# EAGLE design pcbWithuE (EAGLE 9.1.3)

## Sheet 1 of 2: microcontroller
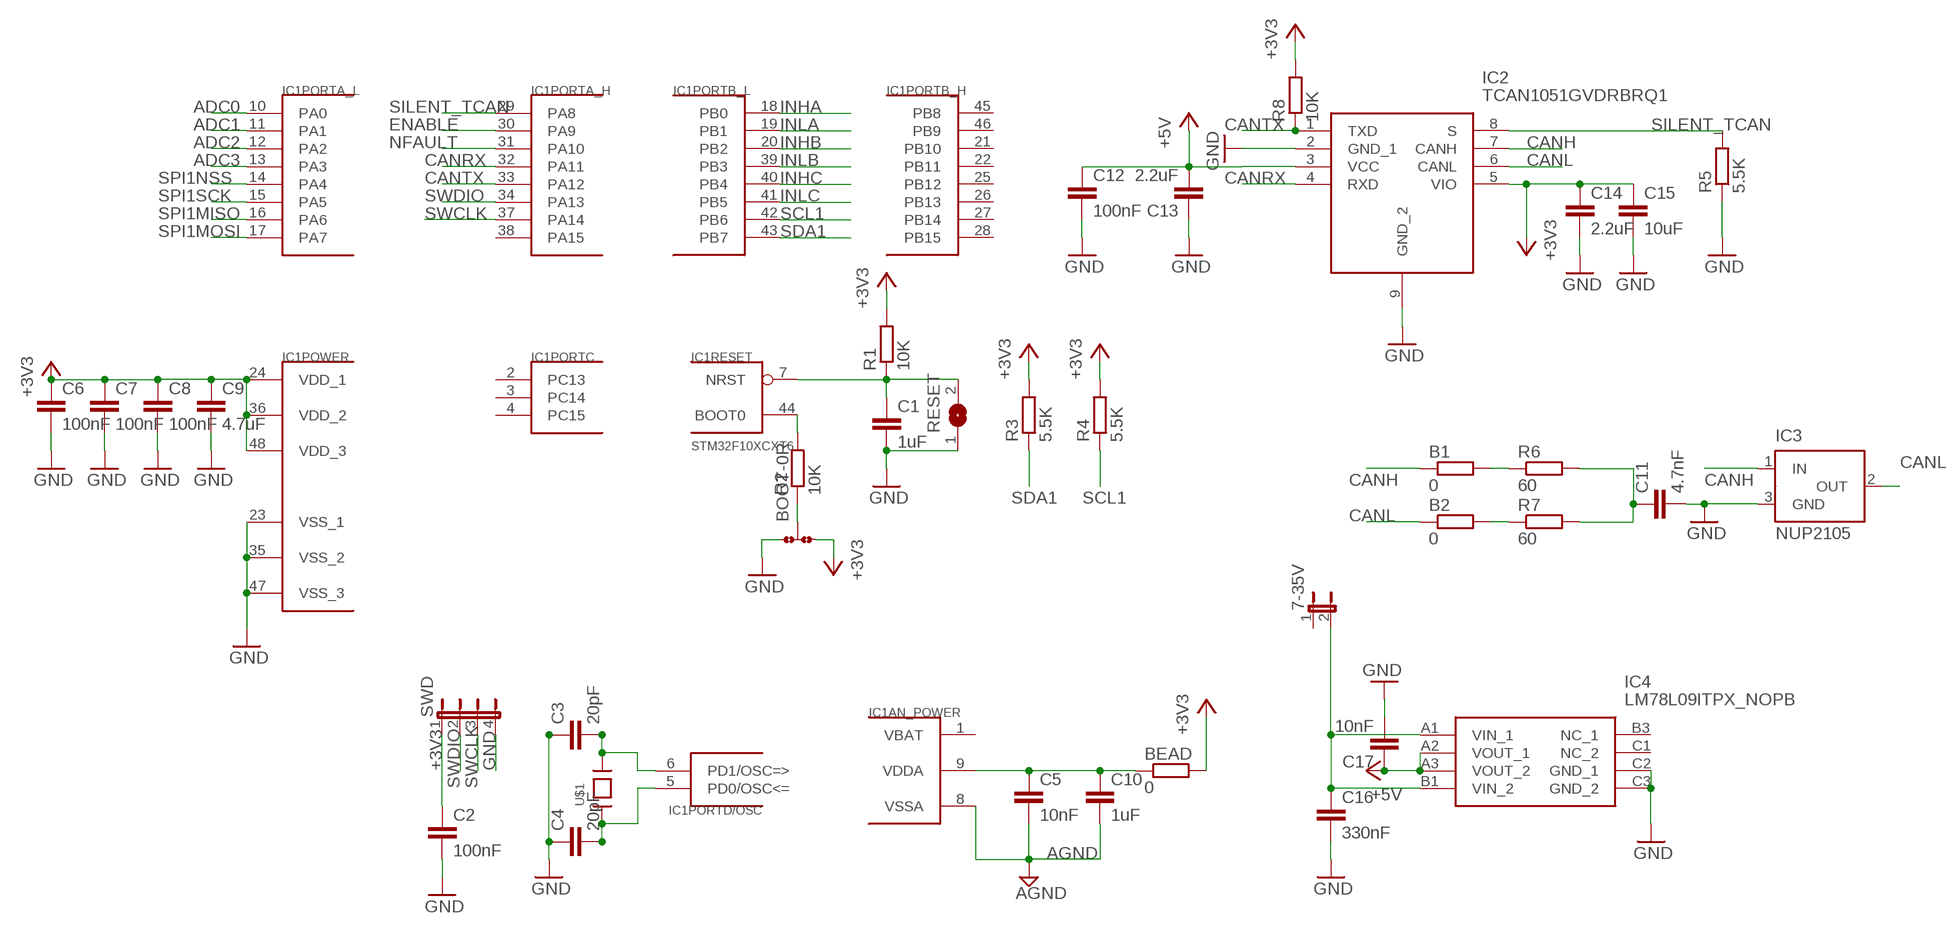
[diagram p0: schematic, sheet 1]

### Parts
7-35V  JP1E  [JP1]
B1  0  R-EU_R0805  [R0805]
B2  0  R-EU_R0805  [R0805]
BEAD  0  R-EU_R0805  [R0805]
BOOT  0R-JUMPB  [B0R-JMP]
C1  1uF  C-EUC0603  [C0603]
C2  100nF  C-EUC0603  [C0603]
C3  20pF  C-EUC0603  [C0603]
C4  20pF  C-EUC0603  [C0603]
C5  10nF  C-EUC0603  [C0603]
C6  100nF  C-EUC0603  [C0603]
C7  100nF  C-EUC0603  [C0603]
C8  100nF  C-EUC0603  [C0603]
C9  4.7uF  C-EUC0805K  [C0805K]
C10  1uF  C-EUC0805K  [C0805K]
C11  4.7nF  C-EUC0402K  [C0402K]
C12  100nF  C-EUC0402K  [C0402K]
C13  2.2uF  C-EUC0402K  [C0402K]
C14  2.2uF  C-EUC0603K  [C0603K]
C15  10uF  C-EUC0603K  [C0603K]
C16  330nF  C-EUC0603  [C0603]
C17  10nF  C-EUC0603  [C0603]
IC1  STM32F10XCXT6  [TQFP48]
IC2  TCAN1051GVDRBRQ1  [DRB-8]
IC3  NUP2105  MAX6520  [SOT23]
IC4  LM78L09ITPX_NOPB  [BGA8C50P3X3_131X131X58]
R1  10K  R-EU_R0603  [R0603]
R2  10K  R-EU_R0603  [R0603]
R3  5.5K  R-EU_R0603  [R0603]
R4  5.5K  R-EU_R0603  [R0603]
R5  5.5K  R-EU_R0402  [R0402]
R6  60  R-EU_R0603  [R0603]
R7  60  R-EU_R0603  [R0603]
R8  10K  R-EU_R0402  [R0402]
RESET  SJ  [SJ]
SWD  JP4E  [JP4]
U$1  QUARZ8MHZ  [SMD5*3.2MM]

### Nets
+3V3: BEAD.2 BOOT.3 C2.1 C6.1 C7.1 C8.1 C9.1 C14.1 C15.1 IC1.24(POWER:VDD_1) IC1.36(POWER:VDD_2) IC1.48(POWER:VDD_3) IC2.5(VIO) R1.2 R3.2 R4.2 R8.2 SWD.1 ; also sheet 2
+5V: C12.1 C13.2 C17.1 IC2.3(VCC) IC4.A2(VOUT_1) IC4.A3(VOUT_2)
ADC0: IC1.10(PORTA_L:PA0)
ADC1: IC1.11(PORTA_L:PA1)
ADC2: IC1.12(PORTA_L:PA2)
ADC3: IC1.13(PORTA_L:PA3)
AGND: C5.2 C10.2 IC1.8(AN_POWER:VSSA) ; also sheet 2
CANH: B1.1 IC2.7(CANH) IC3.1(IN)
CANL: B2.1 IC2.6(CANL) IC3.2(OUT)
CANRX: IC1.32(PORTA_H:PA11) IC2.4(RXD)
CANTX: IC1.33(PORTA_H:PA12) IC2.1(TXD) R8.1
ENABLE: IC1.30(PORTA_H:PA9) ; also sheet 2
GND: BOOT.1 C1.2 C2.2 C3.1 C4.1 C6.2 C7.2 C8.2 C9.2 C11.2 C12.2 C13.1 C14.2 C15.2 C16.2 C17.2 IC1.23(POWER:VSS_1) IC1.35(POWER:VSS_2) IC1.47(POWER:VSS_3) IC2.2(GND_1) IC2.9(GND_2) IC3.3(GND) IC4.C2(GND_1) IC4.C3(GND_2) R5.1 RESET.1 SWD.4 ; also sheet 2
INHA: IC1.18(PORTB_L:PB0) ; also sheet 2
INHB: IC1.20(PORTB_L:PB2) ; also sheet 2
INHC: IC1.40(PORTB_L:PB4) ; also sheet 2
INLA: IC1.19(PORTB_L:PB1) ; also sheet 2
INLB: IC1.39(PORTB_L:PB3) ; also sheet 2
INLC: IC1.41(PORTB_L:PB5) ; also sheet 2
N$1: C1.1 IC1.7(RESET:NRST) R1.1 RESET.2
N$2: C3.2 IC1.6(PORTD/OSC:PD1/OSC=>) U$1.P$2
N$3: C4.2 IC1.5(PORTD/OSC:PD0/OSC<=) U$1.P$1
N$4: IC1.44(RESET:BOOT0) R2.2
N$5: BEAD.1 C5.1 C10.1 IC1.9(AN_POWER:VDDA)
N$6: BOOT.2 R2.1
N$7: C11.1 R6.2 R7.2
N$8: B1.2 R6.1
N$9: B2.2 R7.1
N$10: 7-35V.2 C16.1 IC4.A1(VIN_1) IC4.B1(VIN_2)
NFAULT: IC1.31(PORTA_H:PA10) ; also sheet 2
SCL1: IC1.42(PORTB_L:PB6) R4.1
SDA1: IC1.43(PORTB_L:PB7) R3.1
SILENT_TCAN: IC1.29(PORTA_H:PA8) IC2.8(S) R5.2
SPI1MISO: IC1.16(PORTA_L:PA6)
SPI1MOSI: IC1.17(PORTA_L:PA7)
SPI1NSS: IC1.14(PORTA_L:PA4)
SPI1SCK: IC1.15(PORTA_L:PA5)
SWCLK: IC1.37(PORTA_H:PA14) SWD.3
SWDIO: IC1.34(PORTA_H:PA13) SWD.2
Unconnected: 7-35V.1 IC1.2(PORTC:PC13) IC1.3(PORTC:PC14) IC1.4(PORTC:PC15) IC1.21(PORTB_H:PB10) IC1.22(PORTB_H:PB11) IC1.25(PORTB_H:PB12) IC1.26(PORTB_H:PB13) IC1.27(PORTB_H:PB14) IC1.28(PORTB_H:PB15) IC1.38(PORTA_H:PA15) IC1.45(PORTB_H:PB8) IC1.46(PORTB_H:PB9) IC4.B3(NC_1) IC4.C1(NC_2)

## Sheet 2 of 2: motor driver
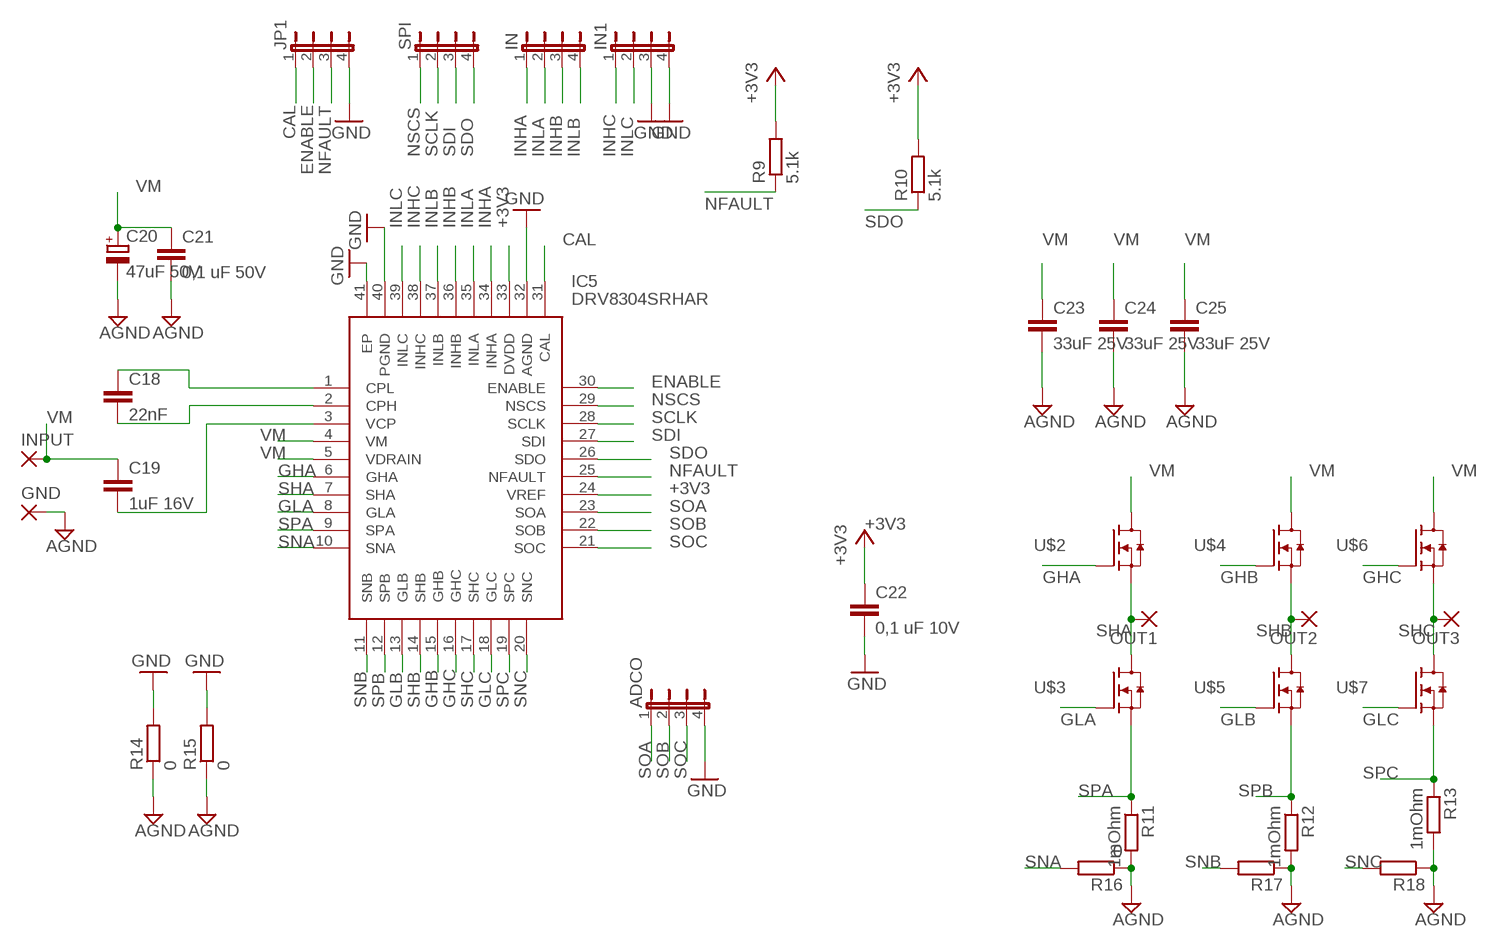
[diagram p1: schematic, sheet 2]

### Parts
ADCO  JP4E  [JP4]
C18  22nF  C-EUC0805K  [C0805K]
C19  1uF 16V  C-EUC0805K  [C0805K]
C20  47uF 50V  CPOL-EUE7.5-16  [E7,5-16]
C21  0,1 uF 50V  C-EUC0805K  [C0805K]
C22  0,1 uF 10V  C-EUC0805K  [C0805K]
C23  33uF 25V  C-EUC1206K  [C1206K]
C24  33uF 25V  C-EUC1206K  [C1206K]
C25  33uF 25V  C-EUC1206K  [C1206K]
GND  3,17/1,3  [3,17/1,3]
IC5  DRV8304SRHAR  [QFN50P600X600X100-41N]
IN  JP4E  [JP4]
IN1  JP4E  [JP4]
INPUT  3,17/1,3  [3,17/1,3]
JP1  JP4E  [JP4]
OUT1  SMD2  [SMD1,27-2,54]
OUT2  SMD2  [SMD1,27-2,54]
OUT3  SMD2  [SMD1,27-2,54]
R9  5.1k  R-EU_R0805  [R0805]
R10  5.1k  R-EU_R0805  [R0805]
R11  1mOhm  R-EU_R1216_SHUNT  [1216]
R12  1mOhm  R-EU_R1216_SHUNT  [1216]
R13  1mOhm  R-EU_R1216_SHUNT  [1216]
R14  0  R-EU_R0805W  [R0805W]
R15  0  R-EU_R0805W  [R0805W]
R16  0  R-EU_R0201  [R0201]
R17  R-EU_R0201  [R0201]
R18  R-EU_R0201  [R0201]
SPI  JP4E  [JP4]
U$2  SIRA80DP-T1-RE3-CLASSIC  [SI7852ADPT1GE3]
U$3  SIRA80DP-T1-RE3-CLASSIC  [SI7852ADPT1GE3]
U$4  SIRA80DP-T1-RE3-CLASSIC  [SI7852ADPT1GE3]
U$5  SIRA80DP-T1-RE3-CLASSIC  [SI7852ADPT1GE3]
U$6  SIRA80DP-T1-RE3-CLASSIC  [SI7852ADPT1GE3]
U$7  SIRA80DP-T1-RE3-CLASSIC  [SI7852ADPT1GE3]

### Nets
+3V3: C22.1 IC5.24(VREF) IC5.33(DVDD) R9.2 R10.2 ; also sheet 1
AGND: C20.- C21.2 C23.2 C24.2 C25.2 GND.1(P) R11.P$2 R11.P$4 R12.P$2 R12.P$4 R13.P$2 R13.P$4 R14.1 R15.1 R16.1 R17.1 R18.1 ; also sheet 1
CAL: IC5.31(CAL) JP1.1
ENABLE: IC5.30(ENABLE) JP1.2 ; also sheet 1
GHA: IC5.6(GHA) U$2.4(G)
GHB: IC5.15(GHB) U$4.4(G)
GHC: IC5.16(GHC) U$6.4(G)
GLA: IC5.8(GLA) U$3.4(G)
GLB: IC5.13(GLB) U$5.4(G)
GLC: IC5.18(GLC) U$7.4(G)
GND: ADCO.4 C22.2 IC5.32(AGND) IC5.40(PGND) IC5.41(EP) IN1.3 IN1.4 JP1.4 R14.2 R15.2 ; also sheet 1
INHA: IC5.34(INHA) IN.1 ; also sheet 1
INHB: IC5.36(INHB) IN.3 ; also sheet 1
INHC: IC5.38(INHC) IN1.1 ; also sheet 1
INLA: IC5.35(INLA) IN.2 ; also sheet 1
INLB: IC5.37(INLB) IN.4 ; also sheet 1
INLC: IC5.39(INLC) IN1.2 ; also sheet 1
N$11: C18.1 IC5.1(CPL)
N$12: C18.2 IC5.2(CPH)
N$13: C19.2 IC5.3(VCP)
NFAULT: IC5.25(NFAULT) JP1.3 R9.1 ; also sheet 1
NSCS: IC5.29(NSCS) SPI.1
SCLK: IC5.28(SCLK) SPI.2
SDI: IC5.27(SDI) SPI.3
SDO: IC5.26(SDO) R10.1 SPI.4
SHA: IC5.7(SHA) OUT1.1(P) U$2.1(S) U$2.2(S) U$2.3(S) U$3.5(D) U$3.6(D) U$3.7(D) U$3.8(D) U$3.9(D) U$3.10(D) U$3.11(D)
SHB: IC5.14(SHB) OUT2.1(P) U$4.1(S) U$4.2(S) U$4.3(S) U$5.5(D) U$5.6(D) U$5.7(D) U$5.8(D) U$5.9(D) U$5.10(D) U$5.11(D)
SHC: IC5.17(SHC) OUT3.1(P) U$6.1(S) U$6.2(S) U$6.3(S) U$7.5(D) U$7.6(D) U$7.7(D) U$7.8(D) U$7.9(D) U$7.10(D) U$7.11(D)
SNA: IC5.10(SNA) R16.2
SNB: IC5.11(SNB) R17.2
SNC: IC5.20(SNC) R18.2
SOA: ADCO.1 IC5.23(SOA)
SOB: ADCO.2 IC5.22(SOB)
SOC: ADCO.3 IC5.21(SOC)
SPA: IC5.9(SPA) R11.P$1 R11.P$3 U$3.1(S) U$3.2(S) U$3.3(S)
SPB: IC5.12(SPB) R12.P$1 R12.P$3 U$5.1(S) U$5.2(S) U$5.3(S)
SPC: IC5.19(SPC) R13.P$1 R13.P$3 U$7.1(S) U$7.2(S) U$7.3(S)
VM: C19.1 C20.+ C21.1 C23.1 C24.1 C25.1 IC5.4(VM) IC5.5(VDRAIN) INPUT.1(P) U$2.5(D) U$2.6(D) U$2.7(D) U$2.8(D) U$2.9(D) U$2.10(D) U$2.11(D) U$4.5(D) U$4.6(D) U$4.7(D) U$4.8(D) U$4.9(D) U$4.10(D) U$4.11(D) U$6.5(D) U$6.6(D) U$6.7(D) U$6.8(D) U$6.9(D) U$6.10(D) U$6.11(D)

## Power pins joined to a net without a drawn wire
VBAT: IC1.1(AN_POWER:VBAT)

## Library data of the parts
7-35V = jumper:JP1E: JUMPER
ADCO IN IN1 JP1 SPI SWD = jumper:JP4E: JUMPER
B1 B2 BEAD R1-R10 R14-R18 = rcl:R-EU_: RESISTOR, European symbol; SPICEPREFIX: R
BOOT = jump-0r-smd:0R-JUMP: SMD 0R 0805 Jumper
C1-C10 C16-C19 C21-C25 = rcl:C-EU: CAPACITOR, European symbol; SPICEPREFIX: C
C11-C15 = resistor_mod:C-EU: CAPACITOR, European symbol
C20 = rcl:CPOL-EU: POLARIZED CAPACITOR, European symbol; SPICEPREFIX: C
GND INPUT = wirepad:3,17/1,3: THROUGH-HOLE PAD
IC1 = stm32:STM32F10XCXT6: ST STM32F101/103 48pin LQFP
IC2 = SamacSys_Parts:TCAN1051GVDRBRQ1: CAN-FD Transeiver with shift level integrated.
IC3 = maxim:MAX6520: 1.2V Voltage Reference 50ppm/°C, SOT23, 3-Terminal Source: Data sheet <http://datasheets.maxim-ic.com/en/ds/MAX6520.pdf>; MF: MAXIM; MPN: MAX6520EUR-T; OC_FARNELL: unknown; OC_NEWARK: 02J4586
IC4 = SamacSys:LM78L09ITPX_NOPB: 100-mA Fixed Output Linear Regulator Source: Datasheet <http://www.ti.com/lit/gpn/lm78l>; DESCRIPTION: 100-mA Fixed Output Linear Regulator; HEIGHT: 0.575mm; MANUFACTURER_NAME: Texas Instruments; MANUFACTURER_PART_NUMBER: LM78L09ITPX/NOPB; MOUSER_PART_NUMBER: 926-LM78L09ITPX/NOPB; MOUSER_PRICE-STOCK: https://www.mouser.com/Search/Refine.aspx?Keyword=926-LM78L09ITPX%2FNOPB
IC5 = SamacSys_Parts2:DRV8304SRHAR: Triple Half Bridge Motor Driver 40-Pin VQFN EP T/R Source: Datasheet <https://www.ti.com/lit/gpn/DRV8304>; DESCRIPTION: Triple Half Bridge Motor Driver 40-Pin VQFN EP T/R; HEIGHT: 1mm; MANUFACTURER_NAME: Texas Instruments; MANUFACTURER_PART_NUMBER: DRV8304SRHAR; MOUSER_PART_NUMBER: 595-DRV8304SRHAR; MOUSER_PRICE-STOCK: https://www.mouser.com/Search/Refine.aspx?Keyword=595-DRV8304SRHAR
OUT1-OUT3 = wirepad:SMD2: SMD PAD
R11-R13 = resistor_mod:R-EU_: SHUNT RESISTOR, European symbol 3W
RESET = jumper:SJ: SMD solder JUMPER
U$1 = myLibrary:QUARZ8MHZ: Quarz
U$2-U$7 = SamacSys_Parts2:SIRA80DP-T1-RE3-CLASSIC

## Board
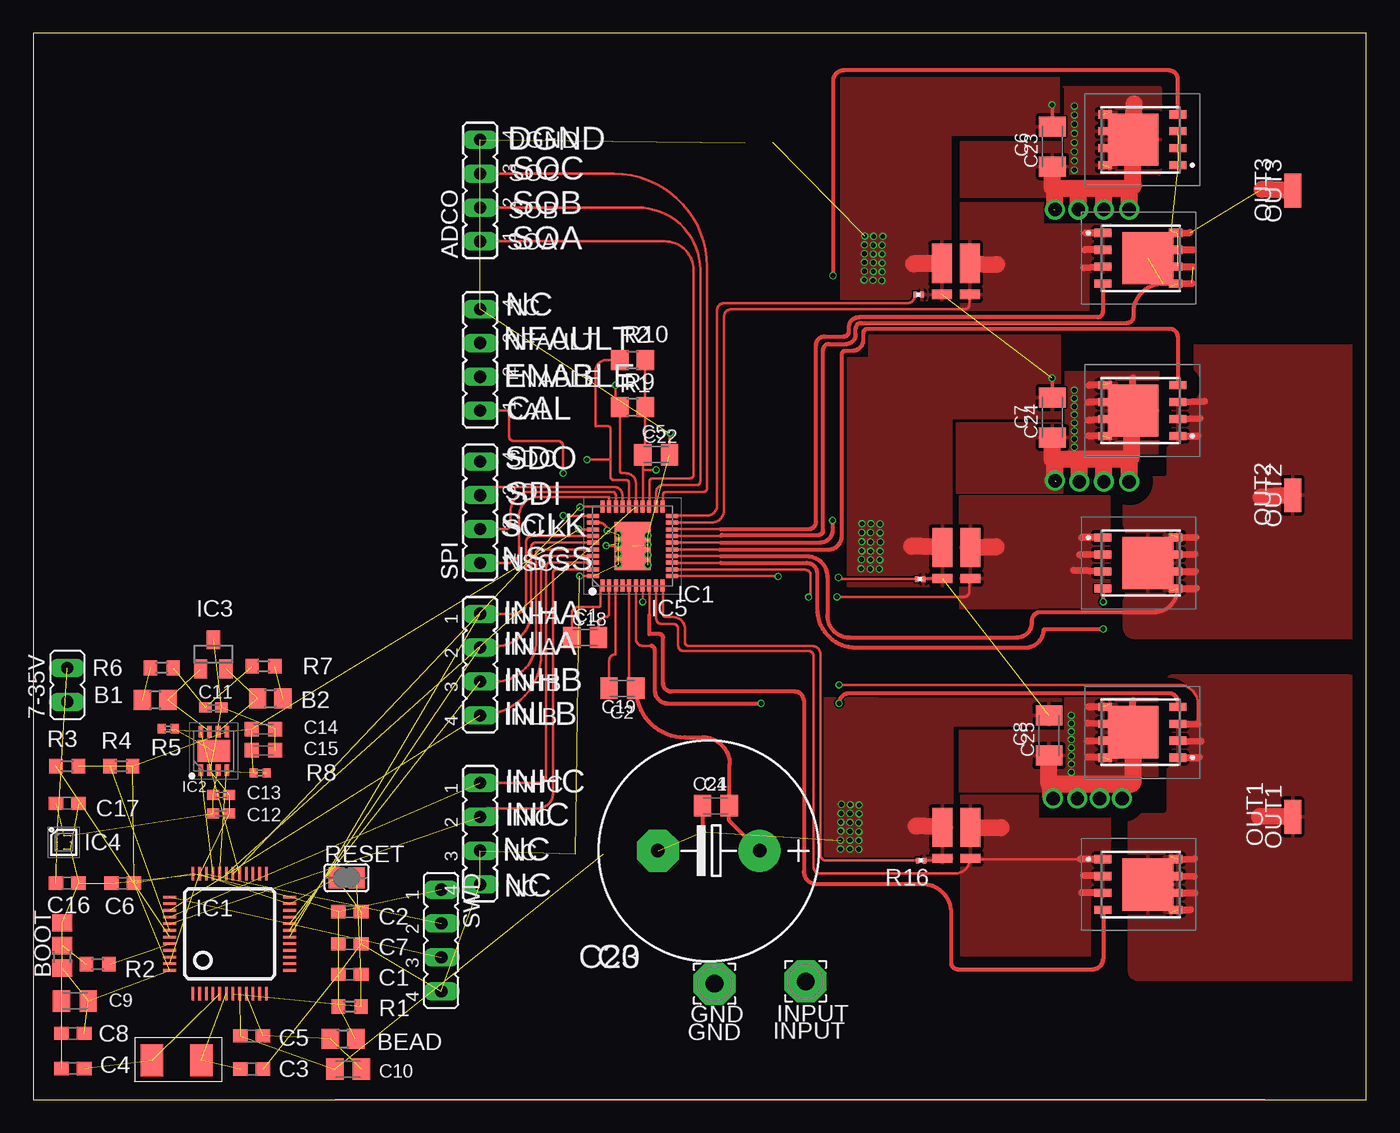
[diagram p2: board, top side]
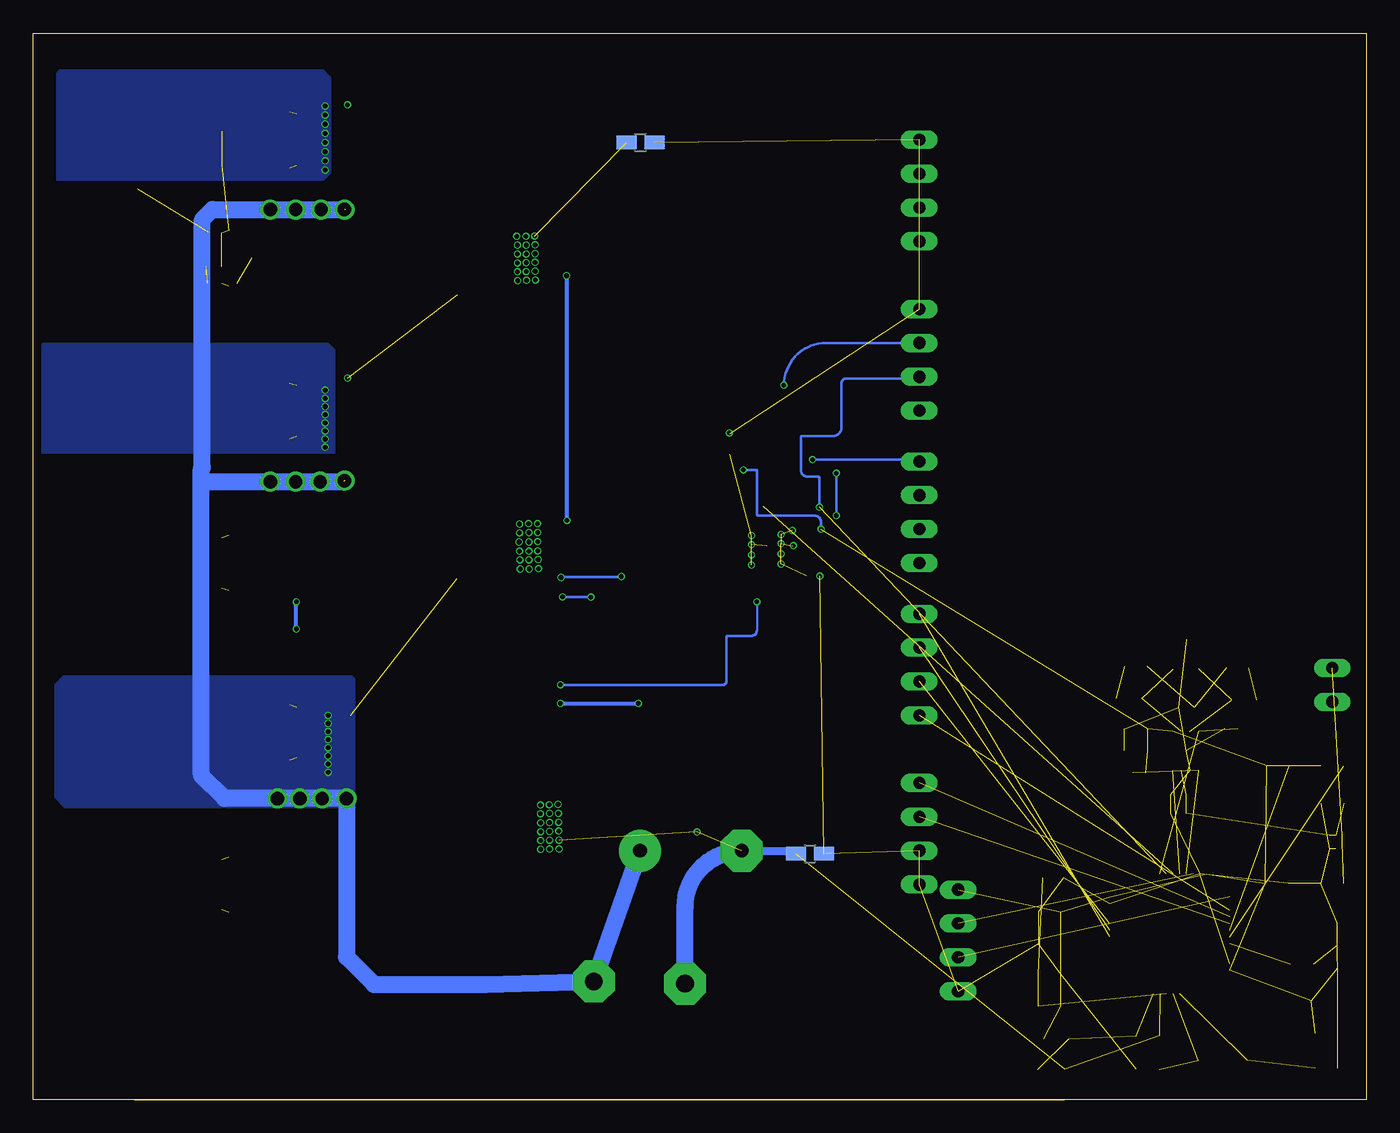
[diagram p3: board, bottom side, seen from below]

Size 100 x 80.01 mm. Coordinates in mm from the lower left corner, seen from the top.
Outline: 92.38,0 22.66,0
Outline: 0,0.01 100,0.01 100,80.01 0,80.01 0,0.01
Copper layers (1*16): Top 0.035559375mm / dielectric 1.6mm / Bottom 0.035559375mm
Design rules "jlcpcb2layer": minimum track width 5mil, minimum drill 12mil, track to track 5mil, track to pad 5mil, pad to pad 5mil, via to via 5mil, smd to smd 5mil, copper to edge 8mil, drill to drill 6mil, minimum pad ring 5mil, minimum via ring 3mil, stop-mask expansion 2.5mil, vias tented up to drill 0mil, thermal gap 10mil

### Footprints (pad centres in the part's own frame; a part is rotated, then mirrored left to right if it is on the bottom)
JP1 = drill 0.914 long: 1 0,-1.27; 2 0,1.27
JP4 = drill 0.914 long: 1 -3.81,0; 2 -1.27,0; 3 1.27,0; 4 3.81,0
R0805 = smd 1.3 x 1.5: 1 -0.95,0; 2 0.95,0
B0R-JMP = smd 1.5 x 1.3: 1 0,1.7; 2 0,0; 3 0,-1.7
C0603 = smd 1.1 x 1: 1 -0.85,0; 2 0.85,0
C0805K = smd 1.3 x 1.6: 1 -1,0; 2 1,0
C0402K = smd 0.925 x 0.74: 1 -0.6,0; 2 0.6,0
C0603K = smd 1.05 x 1.08: 1 -0.875,0; 2 0.875,0
E7,5-16 = drill 1.016 pad 3.15: + -3.81,0 | drill 1.016 pad 3.15 octagon: - 3.81,0
C1206K = smd 1.5 x 2: 1 -1.5,0; 2 1.5,0
3,17/1,3 = drill 1.321 pad 3.175 octagon: 1 0,0
TQFP48 = smd 0.2 x 1: 1 -2.75,-4.5; 2 -2.25,-4.5; 3 -1.75,-4.5; 4 -1.25,-4.5; 5 -0.75,-4.5; 6 -0.25,-4.5; 7 0.25,-4.5; 8 0.75,-4.5; 9 1.25,-4.5; 10 1.75,-4.5; 11 2.25,-4.5; 12 2.75,-4.5; 25 2.75,4.5; 26 2.25,4.5; 27 1.75,4.5; 28 1.25,4.5; 29 0.75,4.5; 30 0.25,4.5; 31 -0.25,4.5; 32 -0.75,4.5; 33 -1.25,4.5; 34 -1.75,4.5; 35 -2.25,4.5; 36 -2.75,4.5 | smd 1 x 0.2: 13 4.5,-2.75; 14 4.5,-2.25; 15 4.5,-1.75; 16 4.5,-1.25; 17 4.5,-0.75; 18 4.5,-0.25; 19 4.5,0.25; 20 4.5,0.75; 21 4.5,1.25; 22 4.5,1.75; 23 4.5,2.25; 24 4.5,2.75; 37 -4.5,2.75; 38 -4.5,2.25; 39 -4.5,1.75; 40 -4.5,1.25; 41 -4.5,0.75; 42 -4.5,0.25; 43 -4.5,-0.25; 44 -4.5,-0.75; 45 -4.5,-1.25; 46 -4.5,-1.75; 47 -4.5,-2.25; 48 -4.5,-2.75
DRB-8 = smd 0.85 x 0.35: 1 -1.45,0.975; 2 -1.45,0.325; 3 -1.45,-0.325; 4 -1.45,-0.975; 5 1.45,-0.975; 6 1.45,-0.325; 7 1.45,0.325; 8 1.45,0.975 | smd 1.65 x 2.45: 9 0,0
SOT23 = smd 1 x 1.4: 1 -0.95,-1.1; 2 0.95,-1.1; 3 0,1.1
BGA8C50P3X3_131X131X58 = smd 0.164 x 0.164: A1 -0.5,0.5; A2 0,0.5; A3 0.5,0.5; B1 -0.5,0; B3 0.5,0; C1 -0.5,-0.5; C2 0,-0.5; C3 0.5,-0.5
QFN50P600X600X100-41N = smd 0.9 x 0.3: 1 -2.95,2.25; 2 -2.95,1.75; 3 -2.95,1.25; 4 -2.95,0.75; 5 -2.95,0.25; 6 -2.95,-0.25; 7 -2.95,-0.75; 8 -2.95,-1.25; 9 -2.95,-1.75; 10 -2.95,-2.25; 21 2.95,-2.25; 22 2.95,-1.75; 23 2.95,-1.25; 24 2.95,-0.75; 25 2.95,-0.25; 26 2.95,0.25; 27 2.95,0.75; 28 2.95,1.25; 29 2.95,1.75; 30 2.95,2.25 | smd 0.3 x 0.9: 11 -2.25,-2.95; 12 -1.75,-2.95; 13 -1.25,-2.95; 14 -0.75,-2.95; 15 -0.25,-2.95; 16 0.25,-2.95; 17 0.75,-2.95; 18 1.25,-2.95; 19 1.75,-2.95; 20 2.25,-2.95; 31 2.25,2.95; 32 1.75,2.95; 33 1.25,2.95; 34 0.75,2.95; 35 0.25,2.95; 36 -0.25,2.95; 37 -0.75,2.95; 38 -1.25,2.95; 39 -1.75,2.95; 40 -2.25,2.95 | smd 3.62 x 2.72: 41 0,0
SMD1,27-2,54 = smd 1.27 x 2.54: 1 0,0
R0603 = smd 1 x 1.1: 1 -0.85,0; 2 0.85,0
R0402 = smd 0.6 x 0.7: 1 -0.5,0; 2 0.5,0
1216 = smd 1.5 x 2.95: P$1 -1.05,-2.075; P$2 1.05,-2.075 | smd 1.5 x 0.7: P$3 -1.05,0.25; P$4 1.05,0.25
R0805W = smd 1.5 x 1: 1 -1.052,0; 2 1.052,0
R0201 = smd 0.28 x 0.43: 1 -0.255,0; 2 0.255,0
SJ = smd 1.168 x 1.6: 1 -0.762,0; 2 0.762,0
SMD5*3.2MM = smd 1.7 x 2.4: P$1 -1.85,0; P$2 1.85,0
SI7852ADPT1GE3 = smd 1.27 x 0.61: 1 -2.81,1.905; 2 -2.81,0.635; 3 -2.81,-0.635; 4 -2.81,-1.905 | smd 0.71 x 0.61: 5 2.81,-1.905; 6 2.81,-0.635; 7 2.81,0.635; 8 2.81,1.905 | smd 3.81 x 3.91: 9 0.55,0 | smd 0.31 x 0.255: 10 2.3,2.083; 11 2.3,-2.083

### Placement (x,y rotation side)
7-35V  2.54,31.12 0 top
ADCO  33.53,68.21 90 top
B1  9.14,29.98 180 top
B2  17.78,30.12 0 top
BEAD  23.24,4.58 0 top
BOOT  2.16,11.57 0 top
C1  23.75,9.41 180 top
C2  23.75,14.11 0 top
C3  16.38,2.3 180 top
C4  2.97,2.35 0 top
C5  16.38,4.79 180 top
C6  6.71,16.24 180 top
C7  23.75,11.69 0 top
C8  2.97,4.98 180 top
C9  3.12,7.4 180 top
C10  23.62,2.3 180 top
C11  13.51,29.42 0 top
C12  14.1,21.47 0 top
C13  14.1,22.87 180 top
C14  17.27,27.8 0 top
C15  17.27,26.21 0 top
C16  2.54,16.24 0 top
C17  2.54,22.24 0 top
C18  41.4,34.68 0 top
C19  44.2,30.87 180 top
C20  50.67,18.68 180 top
C21  51.21,22.06 180 top
C22  46.74,48.4 0 top
C23  76.45,71.51 90 top
C24  76.45,51.19 90 top
C25  76.2,27.32 90 top
GND  51.1,8.7 90 top
IC1  14.73,12.46 0 top
IC2  13.55,26.17 90 top
IC3  13.51,33.41 0 top
IC4  2.29,19.31 0 top
IC5  44.96,41.54 90 top
IN  33.53,32.65 270 top
IN1  33.53,19.95 270 top
INPUT  57.94,8.87 90 top
JP1  33.53,55.51 90 top
OUT1  94.49,21.22 0 top
OUT2  94.49,45.35 0 top
OUT3  94.49,68.21 0 top
R1  23.75,7 180 top
R2  4.83,10.17 0 top
R3  2.54,25.03 0 top
R4  6.6,25.03 0 top
R5  10.12,27.82 180 top
R6  9.64,32.39 0 top
R7  17.27,32.52 180 top
R8  17.02,24.52 180 top
R9  44.96,51.95 0 top
R10  44.96,55.51 0 top
R11  69.24,18.36 180 top
R12  69.24,39.36 180 top
R13  69.21,60.66 180 top
R14  54.46,71.82 0 bottom
R15  41.73,18.45 0 bottom
R16  66.6,17.94 180 top
R17  66.52,39.05 180 top
R18  66.42,60.41 180 top
RESET  23.5,16.65 0 top
SPI  33.53,44.08 90 top
SWD  30.61,11.95 270 top
U$1  10.76,2.96 0 top
U$2  83.06,27.57 180 top
U$3  83.06,16.14 0 top
U$4  83.06,51.7 180 top
U$5  83.06,40.27 0 top
U$6  83.06,72.02 180 top
U$7  83.06,63.13 0 top

### Tracks (layer width: path | path; a pad name or v marks a point on that pad's centre or on a via)
+3V3  (via drill 0.35)  (18 unrouted)
  Top 0.203: IC5.24 arc90 45.74,44.52 45.74,47.25 | 45.74,47.25 C22.1 arc90 45.91,48.57 R9.2 R10.2 | IC5.33 40.91,42.79 arc-90 v40.89,42.81 | v46.74,47.25 45.74,47.25
  Bottom 0.203: v40.89,42.81 40.89,43.32 arc-90 41.4,43.82 45.59,43.82 arc90 45.72,43.95 45.72,47.25 v46.74,47.25
+5V  (5 unrouted)
AGND  (via drill 0.35)  (8 unrouted)
  Top 0.203: R16.1 68.02,17.94 arc90 R11.P$4 | R12.P$4 66.84,39.11 arc90 R17.1
  Top 0.254: C24.2 76.45,54.11 arc90 v76.43,54.14 | C23.2 76.45,74.61 arc90 v76.43,74.64
  Top 0.305: C21.2 50.21,20.09 arc-90 v50.19,20.08
  Top 1.27: R13.P$2 66.06,62.72 | R12.P$2 65.89,41.54 | R11.P$2 66.24,20.53
  Bottom 0.61: C20.- 43.01,18.68 arc90 R15.1
  Bottom 1.27: GND.1 51.1,14.44 arc90 C20.-
  other vias: 62.38,64.81 63.04,64.78 63.73,64.78 62.36,64.15 63.02,64.12 63.68,64.12 62.36,63.48 63.02,63.46 63.68,63.46 62.36,62.82 63.02,62.8 63.68,62.77 62.36,62.16 63.02,62.14 63.68,62.11 62.33,61.5 62.99,61.48 63.65,61.45 62.18,43.22 62.84,43.22 63.53,43.19 62.15,42.55 62.81,42.55 63.53,42.53 62.15,41.87 62.81,41.84 63.55,41.84 62.15,41.18 62.81,41.16 63.53,41.16 62.13,40.52 62.81,40.5 63.5,40.5 62.1,39.84 62.79,39.81 63.47,39.81 60.63,22.16 61.29,22.13 61.95,22.11 60.6,21.47 61.26,21.47 61.95,21.45 60.58,20.81 61.26,20.79 61.93,20.76 60.58,20.15 61.26,20.13 61.93,20.1 60.55,19.47 61.26,19.47 61.93,19.44 60.55,18.81 61.26,18.81 61.93,18.78
  pour Top: 69.01,17.71 69.01,28.03 77.11,28.03 77.11,30.11 68.17,30.11 63.4,30.11 63.4,30.16 59.31,30.16 59.31,30.11 59.31,17.71
  pour Top: 68.83,38.52 68.94,38.52 68.94,51.11 77.06,51.11 77.06,57.36 62.69,57.36 62.69,56.63 62.69,55.97 62.69,55.66 61.09,55.66 61.09,55.53 61.09,38.52
  pour Top: 68.83,59.95 60.58,59.95 60.58,76.67 76.99,76.67 76.99,72.37 68.86,72.37 68.86,59.93
CAL  (via drill 0.35)
  Top 0.203: IC5.31 39.79,43.79 arc-90 v39.75,43.82 | v39.75,47 39.75,49.03 arc90 39.37,49.41 36.07,49.41 arc-90 35.69,49.79 35.69,51.57 arc90 35.56,51.7 JP1.1
  Bottom 0.203: v39.75,43.82 v39.75,47
CANH  (2 unrouted)
CANL  (2 unrouted)
CANRX  (1 unrouted)
CANTX  (2 unrouted)
ENABLE  (via drill 0.35)  (1 unrouted)
  Top 0.203: IC5.30 41.05,44.49 arc90 v41.02,44.46
  Bottom 0.203: v41.02,44.46 41.02,46.62 arc-90 41.15,46.75 41.91,46.75 arc90 42.42,47.25 42.42,49.67 arc90 42.29,49.79 40.01,49.79 arc-90 39.37,50.43 39.37,53.73 arc90 38.99,54.11 33.66,54.11 arc-90 JP1.2
GHA  (via drill 0.35)
  Top 0.203: IC5.6 arc-90 IC5.6 45.21,35.95 45.21,34.55 arc90 45.72,34.05 45.85,34.05 46.35,34.05
  Top 0.305: 46.35,34.05 arc-90 46.61,33.79 46.61,30.74 arc90 47.62,29.73 48.01,29.73 v54.61,29.73 | U$2.4 85.87,29.84 arc90 85.22,30.49 61.21,30.49 arc90 v60.45,29.73
  Bottom 0.305: v60.45,29.73 v54.61,29.73
GHB
  Top 0.203: IC5.15 arc90 IC5.15 51.49,41.28 arc-90 51.51,41.26
  Top 0.305: 51.51,41.26 59.61,41.26 arc90 60.66,42.3 60.66,55.89 arc-90 60.96,56.2 61.44,56.2 arc90 62.28,57.03 62.28,57.54 arc-90 62.59,57.85 85.27,57.85 arc-90 85.85,57.26 85.85,53.62 arc90 U$4.4
GHC  (via drill 0.35)
  Top 0.203: IC5.16 arc-90 IC5.16 51.56,41.79
  Top 0.305: U$6.4 85.87,76.58 arc90 85.22,77.23 60.81,77.23 arc90 59.99,76.41 v59.99,61.83 | 51.56,41.79 59,41.79 arc90 59.97,42.76 v59.97,43.47
  Bottom 0.305: v59.99,61.83 59.99,43.49 v59.97,43.47
GLA
  Top 0.203: 46.21,36.35 arc90 46.23,36.33 46.23,38.57 IC5.8
  Top 0.305: U$3.4 arc-90 80.26,14.22 80.26,10.55 arc-90 79.5,9.79 69.34,9.79 arc-90 68.86,10.27 68.86,14 arc90 66.67,16.19 58.73,16.19 arc-90 57.81,17.1 57.81,29.96 arc90 57.78,29.98 arc90 57.15,30.62 47.88,30.62 arc-90 47.24,31.25 47.24,34.68 arc90 46.99,34.93 46.23,34.93 46.23,36.33
GLB  (via drill 0.35)
  Top 0.203: IC5.13 arc90 47.93,40.27 51.56,40.27
  Top 0.305: 51.56,40.27 58.04,40.27 arc-90 58.8,39.51 58.8,36.84 arc90 61.72,33.92 74.42,33.92 arc90 75.82,35.32 v80.26,35.32 | v80.26,37.35 80.26,38.35 arc90 U$5.4
  Bottom 0.305: v80.26,35.32 v80.26,37.35
GLC
  Top 0.203: IC5.18 arc-90 47.93,42.81 51.56,42.81
  Top 0.305: 80.14,61.11 arc-90 U$7.4 80.25,59.1 arc-90 80.24,59.09 arc-90 79.86,58.71 61.95,58.71 arc90 61.19,57.95 61.19,57.64 arc-90 60.81,57.26 59.36,57.26 arc90 58.73,56.63 58.73,43.37 arc-90 58.17,42.81 51.56,42.81
GND  (via drill 0.35)  (44 unrouted)
  Top 0.203: C22.2 47.74,49.98 arc-90 v47.78,50.02 | IC5.40 arc-90 42,39.28 v41,39.28 | IC5.32 42.47,43.29 arc-90 v43.05,42.71 | IC5.41 43,41.54 arc-90 v42.98,41.56
  other vias: 43.89,42.4 43.89,41.72 43.89,40.95 43.89,40.19 46.1,40.12 46.1,40.88 46.1,41.64 46.1,42.33
INHA  (1 unrouted)
  Top 0.203: IC5.34 arc90 42,42.3 37.47,42.3 arc90 36.96,41.79 36.96,37.22 arc-90 36.2,36.46 IN.1
INHB  (1 unrouted)
  Top 0.203: IC5.36 arc-90 IC5.36 37.97,41.28 arc90 37.72,41.03 37.72,34.43 arc-90 34.67,31.38 IN.3
INHC  (1 unrouted)
  Top 0.203: IC5.38 38.76,40.29 arc90 38.48,40.02 38.48,24.27 arc-90 37.97,23.76 IN1.1
INLA  (1 unrouted)
  Top 0.203: IC5.35 arc90 IC5.35 37.72,41.79 arc90 37.34,41.41 37.34,36.59 arc-90 34.8,34.05 33.53,34.05 IN.2
INLB  (1 unrouted)
  Top 0.203: IC5.37 38.24,40.79 arc90 38.1,40.65 38.1,33.41 arc-90 IN.4
INLC  (1 unrouted)
  Top 0.203: IC5.39 39.27,39.79 arc90 38.99,39.51 38.99,23 arc-90 37.85,21.85 34.16,21.85 arc90 IN1.2
N$1  (3 unrouted)
N$2  (2 unrouted)
N$3  (2 unrouted)
N$4  (1 unrouted)
N$5  (3 unrouted)
N$6  (1 unrouted)
N$7  (2 unrouted)
N$8  (1 unrouted)
N$9  (1 unrouted)
N$10  (3 unrouted)
N$11
  Top 0.203: C18.1 40.4,36.48 arc-90 40.89,36.97 42.42,36.97 arc90 42.55,37.09 42.55,38.43 arc-90 IC5.1
N$12
  Top 0.203: C18.2 42.4,35.68 arc-90 42.93,36.2 arc90 43.21,36.49 IC5.2
N$13
  Top 0.203: IC5.3 arc90 43.69,38.57 43.69,33.41 arc90 43.2,32.92 C19.2
NFAULT  (via drill 0.35)  (1 unrouted)
  Top 0.203: IC5.25 arc90 IC5.25 45.21,46.24 arc90 44.45,47 44.2,47 arc-90 44.01,47.19 R9.1 arc-90 43.69,52.27 v43.69,53.6
  Bottom 0.203: v43.69,53.6 arc90 40.51,56.78 JP1.3
NSCS
  Top 0.203: IC5.29 43.21,45.19 arc90 43.18,45.22 37.85,45.22 arc90 36.45,43.82 36.45,41.16 arc-90 35.56,40.27 SPI.1
SCL1  (1 unrouted)
SCLK
  Top 0.203: IC5.28 43.71,45.33 arc90 43.43,45.6 37.21,45.6 arc90 35.81,44.21 35.81,43.19 arc-90 35.43,42.81 SPI.2
SDA1  (1 unrouted)
SDI
  Top 0.203: IC5.27 arc-90 44.2,44.5 44.2,45.35 arc90 43.56,45.98 34.16,45.98 arc90 SPI.3
SDO  (via drill 0.35)
  Top 0.203: IC5.26 arc-90 IC5.26 44.7,46.24 arc90 44.45,46.49 43.56,46.49 arc-90 43.31,46.75 43.31,48.02 | 43.31,48.02 43.31,50.3 arc90 43.05,50.56 42.16,50.56 42.16,54.62 arc-90 43.05,55.51 R10.1 | v41.53,48.02 43.31,48.02
  Bottom 0.203: SPI.4 arc-90 33.66,48.02 v41.53,48.02
SHA  (via drill 0.35)  (2 unrouted)
  Top 0.152: 45.72,38.58 v45.72,37.35
  Top 0.203: IC5.7 arc-90 45.72,38.58 | v60.45,31.12 85.93,31.12 arc-90 87.38,29.68 87.38,28.18
  Top 0.508: U$2.3 87.38,28.18 | U$2.2 87.61,26.88 | U$2.1 87.5,25.69 | U$3.8 87.12,18.07 | U$3.7 87.07,16.75 | U$3.6 87.15,15.5 | U$3.5 86.82,14.26
  Top 1.27: U$3.9 83.51,16.23 arc-45 83.44,16.41 | OUT1.1 92,21.24
  Bottom 0.152: v45.72,37.35 45.72,35.19
  Bottom 0.203: 45.72,35.19 arc90 46.1,34.81 47.88,34.81 arc-90 48.01,34.68 48.01,31.38 arc90 48.26,31.12 v60.45,31.12
  pour Top (isolate 1.016): 97.92,8.9 82.93,8.9 arc-90 82.17,9.66 82.17,21.35 arc-90 82.3,21.47 84.71,21.47 arc90 85.09,21.85 85.09,31.51 arc-90 85.47,31.89 98.68,31.89 arc-90 99.19,31.38 99.19,8.9
SHB  (2 unrouted)
  Top 0.203: IC5.14 arc90 47.92,40.78 51.56,40.78
  Top 0.305: 51.56,40.78 58.04,40.78 arc-90 59.56,39.25 59.56,36.33 arc90 61.21,34.68 73.79,34.68 arc90 74.93,35.82 74.93,35.95 arc-90 75.56,36.59 84.09,36.59 arc90 U$5.5
  Top 0.508: U$4.1 87.38,49.79 | U$4.2 87.55,51.14 | U$4.3 87.86,52.41 | U$5.8 87.25,42.2 | U$5.7 87.15,40.93 | U$5.6 87.2,39.63 | U$5.5 87.27,38.36
  Top 1.27: OUT2.1 92.1,45.2
  pour Top (isolate 1.016): 99.19,34.55 82.68,34.55 arc-90 81.79,35.44 81.79,46.24 arc-90 82.3,46.75 84.84,46.75 arc90 85.09,47 85.09,56.65 99.19,56.65
SHC  (10 unrouted)
  Top 0.203: IC5.17 arc-90 IC5.17 51.56,42.3
  Top 0.305: 51.56,42.3 51.64,42.38 58.93,42.38 arc90 59.26,42.71 59.26,56.27 arc-90 59.69,56.7 60.98,56.7 arc90 61.7,57.41 61.7,57.9 arc-90 61.72,57.92 arc-90 62.08,58.28 82.04,58.28 arc90 82.55,58.79 82.55,59.04 arc-90 84.73,61.22 U$7.5
  Top 0.508: U$7.8 86.79,65.06 | U$7.7 87,63.76 | U$7.6 87.02,62.49 | U$7.5 86.92,61.25
  Top 1.27: OUT3.1 92.18,68.31
SILENT_TCAN  (2 unrouted)
SNA
  Top 0.203: IC5.10 arc-90 47.24,38.55 47.24,36.46 arc90 47.5,36.2 48.01,36.2 arc-90 48.9,35.32 48.9,34.3 arc90 49.15,34.05 58.42,34.05 arc-90 59.05,33.41 59.05,18.35 arc90 59.46,17.94 R16.2
SNB  (via drill 0.35)
  Top 0.203: v55.88,39.25 arc90 55.84,39.29 IC5.11 | R17.2 60.53,39.05 arc90 v60.4,39.18
  Bottom 0.203: v55.88,39.25 arc90 55.91,39.23 60.35,39.23 v60.4,39.18
SNC
  Top 0.203: IC5.20 arc-90 47.94,43.82 49.78,43.82 50.55,43.82 arc90 51.31,44.59 51.31,45.48 51.31,59.27 arc-90 51.79,59.75 65.51,59.75 arc90 R18.2
SOA
  Top 0.203: IC5.23 arc90 46.23,44.51 46.23,46.36 arc-90 46.48,46.62 49.28,46.62 arc90 49.53,46.87 49.53,62.24 arc90 47.37,64.4 ADCO.1
SOB
  Top 0.203: IC5.22 arc90 46.74,44.52 46.74,45.6 arc-90 47.24,46.11 49.78,46.11 arc90 50.04,46.36 50.04,62.24 arc90 45.34,66.94 ADCO.2
SOC
  Top 0.203: IC5.21 arc90 47.24,44.52 47.24,45.35 arc-90 47.5,45.6 50.29,45.6 arc90 50.55,45.86 50.55,62.49 arc90 43.56,69.48 ADCO.3
SPA
  Top 0.203: IC5.9 arc-90 46.74,38.56 46.74,36.08 arc90 47.12,35.7 48.01,35.7 arc-90 48.39,35.32 48.39,34.05 arc90 48.77,33.66 58.17,33.66 arc-90 58.55,33.28 58.55,17.43 arc90 59,16.98 69.16,16.98 arc90 R11.P$3 arc90 70.35,18.04 78.54,18.04
  Top 0.508: U$3.3 78.64,15.53 | U$3.2 78.82,16.8 | U$3.1 78.54,18.04
  Top 1.27: R11.P$1 72.62,20.41
  pour Top: 80.64,15.12 79.32,15.12 79.32,10.8 69.6,10.8 69.6,22.29 69.6,22.82 75.11,22.82 75.41,22.82 75.41,21.09 80.8,21.09 80.8,15.3 80.82,15.3
SPB  (via drill 0.35)
  Top 0.203: IC5.12 arc90 47.94,39.76 57.91,39.76 arc-90 58.32,39.35 58.32,37.86 arc-90 v58.17,37.7 | v60.3,37.73 69.85,37.73 arc90 70.23,38.11 70.23,39.05 arc-90 R12.P$3
  Top 0.508: U$5.3 78.05,39.71 | U$5.2 78.51,40.88 | U$5.1 78.64,42.17
  Top 1.27: R12.P$1 72.24,41.49
  Bottom 0.203: v58.17,37.7 60.27,37.7 arc90 v60.3,37.73
  pour Top: 69.52,42.94 69.52,36.87 80.77,36.87 80.77,45.27 80.11,45.27 69.49,45.27 69.49,42.96
SPC
  Top 0.203: IC5.19 arc-90 47.94,43.32 50.93,43.32 arc90 51.82,44.21 51.82,58.45 51.82,58.73 arc-90 52.4,59.32 69.91,59.32 arc90 70.23,59.64 70.23,60.38 arc-90 R13.P$3
  Top 0.508: U$7.3 78.82,62.39 | U$7.2 78.87,63.76 | U$7.1 78.94,65.03
  Top 1.27: R13.P$1 72.26,62.67
  pour Top: 80.9,62.04 79.2,62.04 79.2,59.24 69.57,59.24 69.57,67.29 75.77,67.29 75.77,65.69 80.87,65.69 80.87,62.06
SWCLK  (1 unrouted)
SWDIO  (1 unrouted)
VM  (via drill 0.35, 1)  (8 unrouted)
  Top 0.203: IC5.4 IC5.5 arc90 IC5.5 44.7,31.36 arc90 C19.1
  Top 0.305: C19.1 arc90 48.88,27.19 50.24,27.19 arc-90 52.25,25.18 52.25,22.1 arc-90 C21.1 52.21,20.96 C20.+
  Top 0.508: U$4.9 82.5,54.16 | U$4.5 79.2,53.6 | U$4.6 79.15,52.33 | U$4.7 79.17,50.96 | U$4.8 79.17,49.79 | U$2.8 79.1,25.69 | U$2.7 79.05,26.88 | U$2.6 79.1,28.23 | U$2.5 79.17,29.47 | U$2.9 82.51,29.94 82.53,29.96
  Top 1.016: 76.2,23.66 76.2,22.85 arc90 76.45,22.59 v76.5,22.59 | v78.33,22.59 78.33,23.51 arc90 78.18,23.66 | v80.01,22.59 80.01,23.58 arc90 79.93,23.66 | v81.69,22.59 81.69,23.4 arc-90 81.94,23.66 82.25,23.66
  Top 1.27: U$2.9 82.51,23.91 arc-90 82.25,23.66 79.93,23.66 78.18,23.66 76.2,23.66 C25.1 | U$4.9 arc90 82.37,51.56 82.37,48.29 arc-90 82.12,48.04 | 82.12,48.04 80.39,48.04 | 80.39,48.04 78.49,48.04 | 78.49,48.04 76.43,48.04 | 76.43,48.04 arc90 76.45,48.07 C24.1 | C23.1 arc90 76.43,69.99 76.43,68.54 arc90 76.58,68.39 | 82.25,68.39 arc90 82.51,68.64 U$6.9 82.6,74.71 | 76.58,68.39 78.41,68.39 | 78.41,68.39 80.39,68.39 | 80.39,68.39 82.25,68.39 | v76.66,66.79 76.66,68.2 arc45 76.58,68.39 | v78.41,66.79 78.41,68.39 | v80.31,66.79 80.31,68.2 arc-45 80.39,68.39 | v82.22,66.79 82.22,68.3 arc-45 82.25,68.39 | v82.22,46.36 82.22,47.84 arc45 82.14,48.01 82.12,48.04 | v80.31,46.36 80.31,47.86 arc-45 80.39,48.04 | v78.49,46.36 78.49,48.04 | v76.66,46.44 76.66,47.71 arc45 76.58,47.89 76.43,48.04
  Bottom 1.27: 87.4,46.36 76.73,46.36 | 87.4,46.36 87.4,24.45 arc-45 87.33,24.27 85.65,22.59 v81.69,22.59 v80.01,22.59 v78.33,22.59 v76.5,22.59 76.5,10.7 74.45,8.65 66.06,8.65 INPUT.1 C20.+ | 76.58,66.79 86.56,66.79 87.33,66.02 87.33,47.43 arc-45 87.4,47.25 87.4,46.36
  other vias: 78.11,74.56 78.11,73.87 78.11,73.19 78.11,72.5 78.11,71.82 78.11,71.13 78.11,70.44 78.11,69.76 78.11,48.96 78.11,49.57 78.11,50.17 78.11,50.78 78.11,53.22 78.11,52 78.11,51.39 78.11,52.61 77.88,24.57 77.88,25.18 77.88,25.79 77.88,26.4 77.88,27.01 77.88,27.62 77.88,28.23 77.88,28.84
  pour Top: 84.43,69.45 77.5,69.45 77.42,69.38 77.42,75.85 77.27,76.01 84.51,76.01 84.58,75.93 84.58,69.53 84.43,69.38
  pour Bottom (isolate 0.813): 79.93,69 98.22,69 98.22,77 97.99,77.23 78.26,77.23 77.72,76.69 77.72,69.53 78.26,69 79.86,69
  pour Bottom: 77.42,48.5 99.29,48.5 99.29,56.73 77.88,56.73 77.8,56.65 77.42,56.27
  pour Top: 84.43,49.18 84.43,54.59 77.42,54.59 77.42,48.5 84.35,48.5 84.35,49.11
  pour Top: 84.37,24.34 84.37,30.04 84.28,30.13 77.39,30.13 77.39,29.65 77.39,24.34 77.42,24.34 84.05,24.34
  pour Top: 75.69,23.07 69.49,23.07 69.49,27.7 77.5,27.7 77.5,27.65 77.52,27.65 77.52,23.07 75.69,23.07
  pour Top: 69.27,50.76 77.24,50.76 77.24,45.53 69.27,45.53
  pour Top: 69.55,67.7 69.55,71.89 77.17,71.89 77.17,67.7
  pour Bottom: 75.84,23.28 75.84,31.56 76.07,31.79 97.74,31.79 98.4,31.12 98.4,23.4 98.4,22.67 97.66,21.93 75.87,21.93 75.84,21.9

### Text on the board
tNames: DGND | SOC | SOB | SOA | NC | NFAULT | ENABLE | CAL | SDO | SDI | SCLK | NSCS | INHA | INLA | INHB | INLB | INHC | INlC | NC | NC
tsilk: DGND | C6 | SOC | SOB | OUT3 | SOA | ADCO | NC | R2 | NFAULT | ENABLE | R1 | CAL | C5 | C7 | SDO | SDI | OUT2 | SCLK | NSCS | SPI | IC1 | INHA | C1 | INLA | INHB | C2 | INLB | C8 | C4 | INHC | INlC | OUT1 | NC | NC | C3 | GND | INPUT